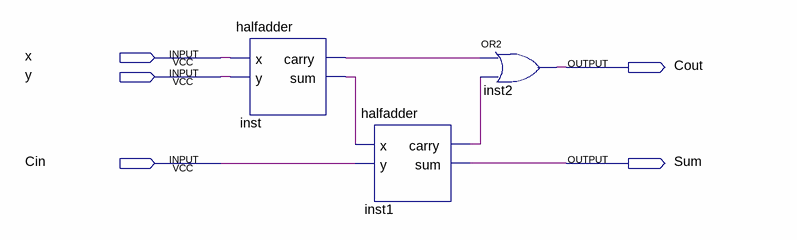
[diagram p0: schematic sheet]
// Quartus schematic Project1.bdf as structural Verilog: 3 symbols, 5 pins
module Project1 (
  input  x,
  input  y,
  input  Cin,
  output Cout,
  output Sum
);

  wire inst1_carry, inst_carry, inst_sum;

  halfadder inst (.x(x), .y(y), .carry(inst_carry), .sum(inst_sum));
  halfadder inst1 (.x(inst_sum), .y(Cin), .carry(inst1_carry), .sum(Sum));
  or inst2 (Cout, inst_carry, inst1_carry);
endmodule
